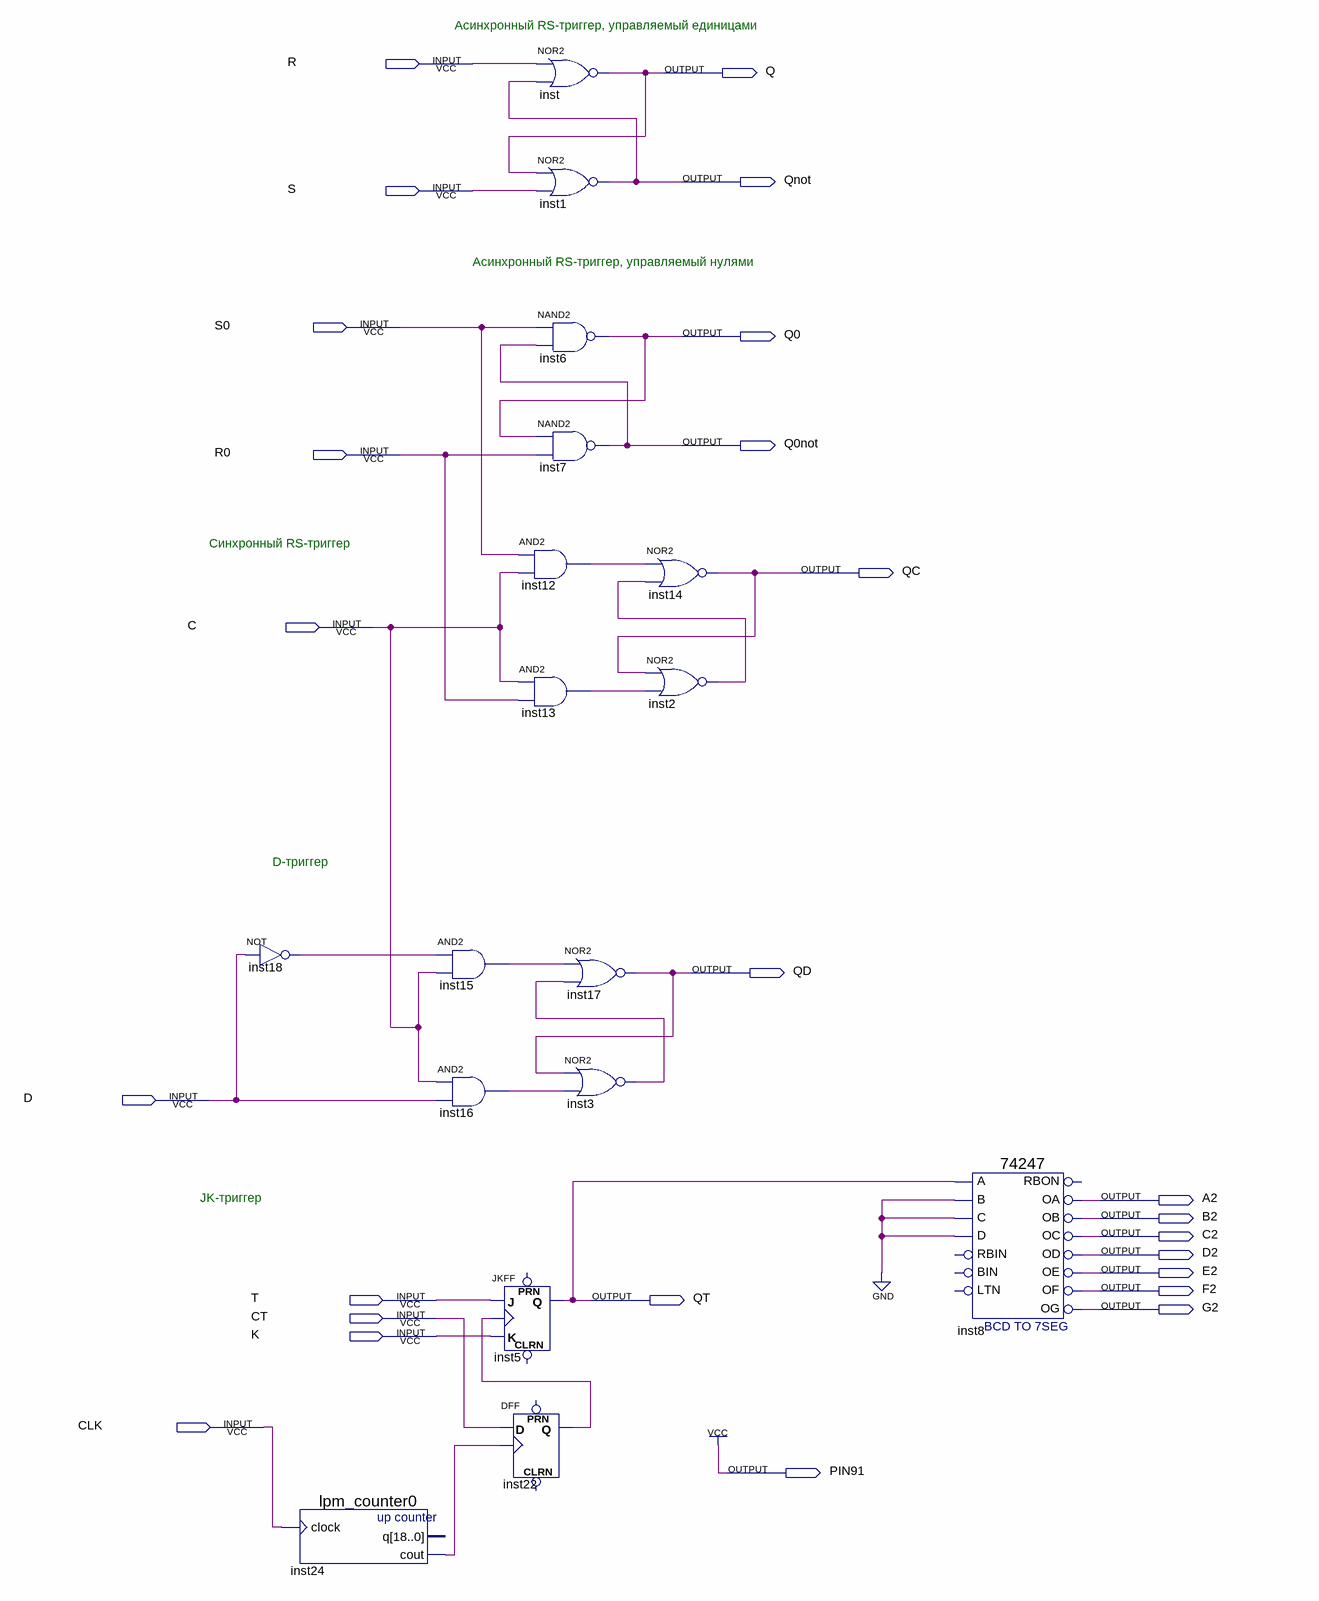
[diagram p0: schematic sheet]
// Quartus schematic Triggers.bdf as structural Verilog: 17 symbols, 25 pins
module Triggers (
  input  R,
  input  S,
  input  S0,
  input  R0,
  input  C,
  input  D,
  input  T,
  input  CT,
  input  K,
  input  CLK,
  output Q,
  output Qnot,
  output Q0,
  output Q0not,
  output QC,
  output QD,
  output A2,
  output B2,
  output C2,
  output D2,
  output E2,
  output F2,
  output QT,
  output G2,
  output PIN91
);

  wire inst2_out, inst3_out, inst12_out, inst13_out, inst15_out, inst16_out, inst18_out, inst22_q,
       inst24_cout;

  not inst18 (inst18_out, D);
  lpm_counter0 inst24 (.clock(CLK), .cout(inst24_cout));  // open: q
  and inst15 (inst15_out, inst18_out, C);
  and inst16 (inst16_out, C, D);
  nor inst (Q, R, Qnot);
  nor inst1 (Qnot, Q, S);
  nand inst6 (Q0, S0, Q0not);
  nand inst7 (Q0not, Q0, R0);
  and inst12 (inst12_out, S0, C);
  and inst13 (inst13_out, C, R0);
  JKFF inst5 (.K(K), .J(T), .CLK(inst22_q), .Q(QT));  // open: PRN, CLRN
  DFF inst22 (.CLK(inst24_cout), .D(CT), .Q(inst22_q));  // open: CLRN, PRN
  nor inst17 (QD, inst15_out, inst3_out);
  nor inst3 (inst3_out, QD, inst16_out);
  nor inst14 (QC, inst12_out, inst2_out);
  nor inst2 (inst2_out, QC, inst13_out);
  \74247  inst8 (
    .A(QT), .B(1'b0), .C(1'b0), .D(1'b0), .OF(F2), .OC(C2), .OD(D2), .OE(E2), .OA(A2), .OB(B2), .OG(G2));  // open: LTN, BIN, RBIN, RBON

  assign PIN91 = 1'b1;

  // Notes on the sheet:
  //   Асинхронный RS-триггер, управляемый единицами
  //   Асинхронный RS-триггер, управляемый нулями
  //   Синхронный RS-триггер
  //   D-триггер
  //   JK-триггер
endmodule
